# EAGLE schematic gemensamt_avr (EAGLE 7.1.0)

## Sheet 1 of 3: Sensorenhet
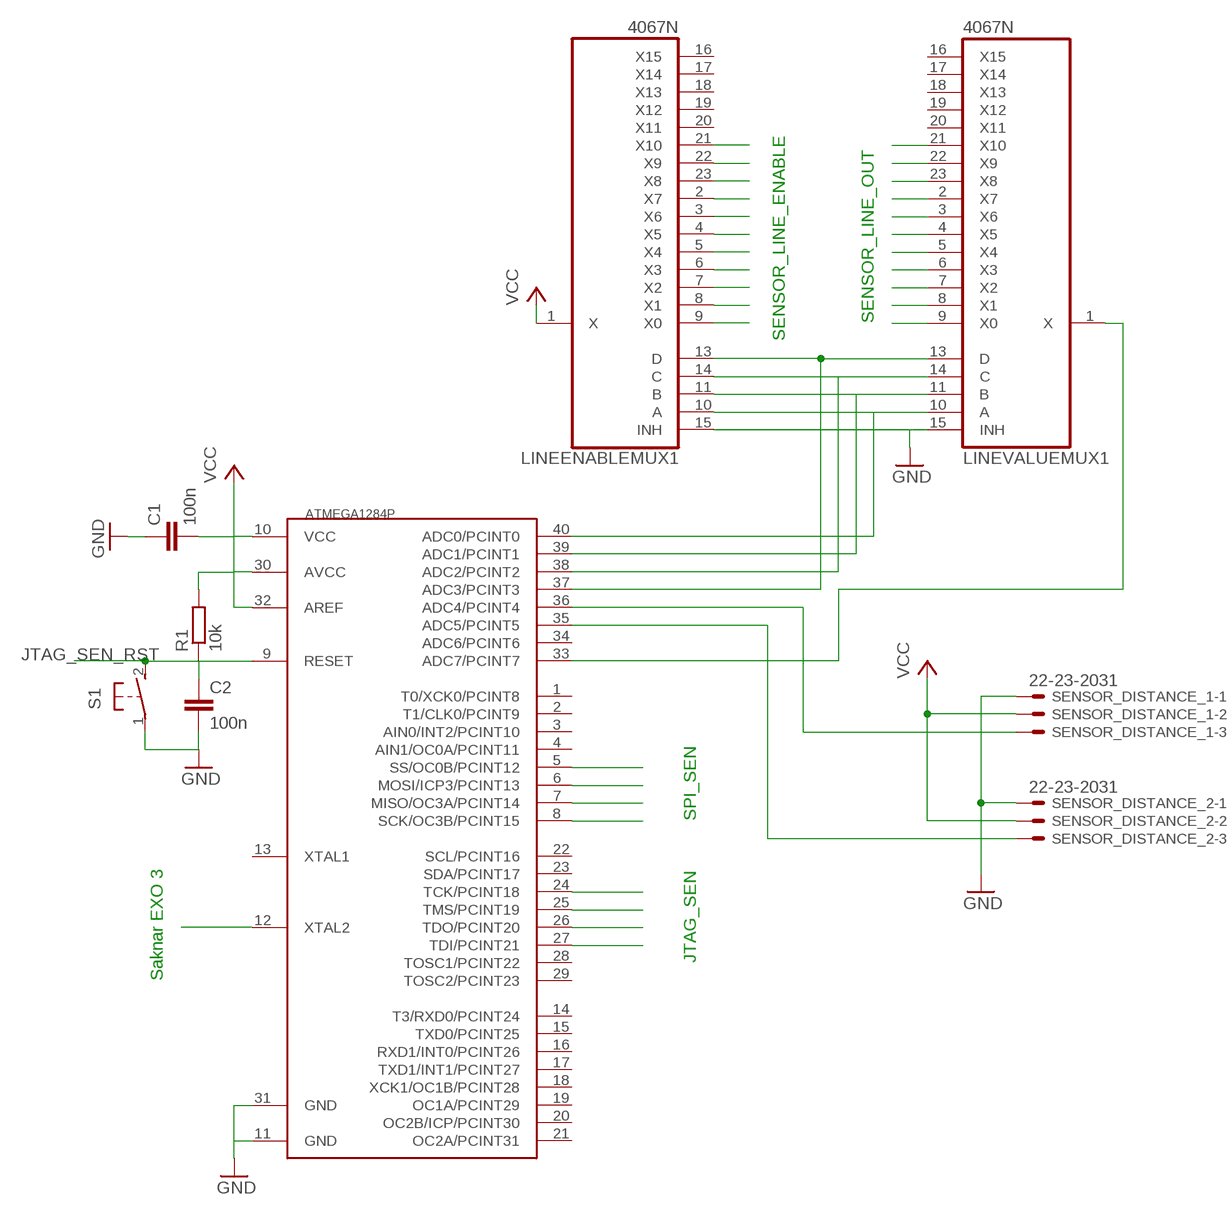
[diagram p0: schematic, sheet 1]

### Parts
ATMEGA1284P  MEGA1284P  [DIL40]
C1  100n  C-EUC1206  [C1206]
C2  100n  C-EUC1206  [C1206]
LINEENABLEMUX1  4067N  [DIL24-6]
LINEVALUEMUX1  4067N  [DIL24-6]
R1  10k  R-EU_V235/17  [V235/17]
S1  31-XX  [B3F-31XX]
SENSOR_DISTANCE_1  22-23-2031  [22-23-2031]
SENSOR_DISTANCE_2  22-23-2031  [22-23-2031]

### Nets
DISTANCELEFT: ATMEGA1284P.36(ADC4/PCINT4) SENSOR_DISTANCE_1.3
DISTANCERIGHT: ATMEGA1284P.35(ADC5/PCINT5) SENSOR_DISTANCE_2.3
GND: ATMEGA1284P.11(GND) ATMEGA1284P.31(GND) C1.1 C2.2 LINEENABLEMUX1.15(INH) LINEVALUEMUX1.15(INH) S1.1(P) SENSOR_DISTANCE_1.1 SENSOR_DISTANCE_2.1 ; also sheet 2,3
JTAG_SEN_RST: ATMEGA1284P.9(RESET) C2.1 R1.1 S1.2(S) ; also sheet 3
JTAG_SEN_TCK: ATMEGA1284P.24(TCK/PCINT18) ; also sheet 3
JTAG_SEN_TDI: ATMEGA1284P.27(TDI/PCINT21) ; also sheet 3
JTAG_SEN_TDO: ATMEGA1284P.26(TDO/PCINT20) ; also sheet 3
JTAG_SEN_TMS: ATMEGA1284P.25(TMS/PCINT19) ; also sheet 3
LINE_0_E: LINEENABLEMUX1.9(X0) ; also sheet 3
LINE_0_OUT: LINEVALUEMUX1.9(X0) ; also sheet 3
LINE_1_E: LINEENABLEMUX1.8(X1) ; also sheet 3
LINE_1_OUT: LINEVALUEMUX1.8(X1) ; also sheet 3
LINE_2_E: LINEENABLEMUX1.7(X2) ; also sheet 3
LINE_2_OUT: LINEVALUEMUX1.7(X2) ; also sheet 3
LINE_3_E: LINEENABLEMUX1.6(X3) ; also sheet 3
LINE_3_OUT: LINEVALUEMUX1.6(X3) ; also sheet 3
LINE_4_E: LINEENABLEMUX1.5(X4) ; also sheet 3
LINE_4_OUT: LINEVALUEMUX1.5(X4) ; also sheet 3
LINE_5_E: LINEENABLEMUX1.4(X5) ; also sheet 3
LINE_5_OUT: LINEVALUEMUX1.4(X5) ; also sheet 3
LINE_6_E: LINEENABLEMUX1.3(X6) ; also sheet 3
LINE_6_OUT: LINEVALUEMUX1.3(X6) ; also sheet 3
LINE_7_E: LINEENABLEMUX1.2(X7) ; also sheet 3
LINE_7_OUT: LINEVALUEMUX1.2(X7) ; also sheet 3
LINE_8_E: LINEENABLEMUX1.23(X8) ; also sheet 3
LINE_8_OUT: LINEVALUEMUX1.23(X8) ; also sheet 3
LINE_9_E: LINEENABLEMUX1.22(X9) ; also sheet 3
LINE_9_OUT: LINEVALUEMUX1.22(X9) ; also sheet 3
LINE_10_E: LINEENABLEMUX1.21(X10) ; also sheet 3
LINE_10_OUT: LINEVALUEMUX1.21(X10) ; also sheet 3
LINEADDR0: ATMEGA1284P.40(ADC0/PCINT0) LINEENABLEMUX1.10(A) LINEVALUEMUX1.10(A)
LINEADDR1: ATMEGA1284P.39(ADC1/PCINT1) LINEENABLEMUX1.11(B) LINEVALUEMUX1.11(B)
LINEADDR2: ATMEGA1284P.38(ADC2/PCINT2) LINEENABLEMUX1.14(C) LINEVALUEMUX1.14(C)
LINEADDR3: ATMEGA1284P.37(ADC3/PCINT3) LINEENABLEMUX1.13(D) LINEVALUEMUX1.13(D)
LINEVALUE: ATMEGA1284P.33(ADC7/PCINT7) LINEVALUEMUX1.1(X)
SEN_CLK: ATMEGA1284P.12(XTAL2)
SPI_MISO: ATMEGA1284P.7(MISO/OC3A/PCINT14) ; also sheet 2
SPI_MOSI: ATMEGA1284P.6(MOSI/ICP3/PCINT13) ; also sheet 2,3
SPI_SCK: ATMEGA1284P.8(SCK/OC3B/PCINT15) ; also sheet 2,3
SPI_SS_SEN: ATMEGA1284P.5(SS/OC0B/PCINT12) ; also sheet 3
VCC: ATMEGA1284P.10(VCC) ATMEGA1284P.30(AVCC) ATMEGA1284P.32(AREF) C1.2 LINEENABLEMUX1.1(X) R1.2 SENSOR_DISTANCE_1.2 SENSOR_DISTANCE_2.2 ; also sheet 2,3
Unconnected: ATMEGA1284P.1(T0/XCK0/PCINT8) ATMEGA1284P.2(T1/CLK0/PCINT9) ATMEGA1284P.3(AIN0/INT2/PCINT10) ATMEGA1284P.4(AIN1/OC0A/PCINT11) ATMEGA1284P.13(XTAL1) ATMEGA1284P.14(T3/RXD0/PCINT24) ATMEGA1284P.15(TXD0/PCINT25) ATMEGA1284P.16(RXD1/INT0/PCINT26) ATMEGA1284P.17(TXD1/INT1/PCINT27) ATMEGA1284P.18(XCK1/OC1B/PCINT28) ATMEGA1284P.19(OC1A/PCINT29) ATMEGA1284P.20(OC2B/ICP/PCINT30) ATMEGA1284P.21(OC2A/PCINT31) ATMEGA1284P.22(SCL/PCINT16) ATMEGA1284P.23(SDA/PCINT17) ATMEGA1284P.28(TOSC1/PCINT22) ATMEGA1284P.29(TOSC2/PCINT23) ATMEGA1284P.34(ADC6/PCINT6) LINEENABLEMUX1.16(X15) LINEENABLEMUX1.17(X14) LINEENABLEMUX1.18(X13) LINEENABLEMUX1.19(X12) LINEENABLEMUX1.20(X11) LINEVALUEMUX1.16(X15) LINEVALUEMUX1.17(X14) LINEVALUEMUX1.18(X13) LINEVALUEMUX1.19(X12) LINEVALUEMUX1.20(X11)

### Notes on the sheet
- SENSOR_LINE_OUT
- SENSOR_LINE_ENABLE
- SPI_SEN
- JTAG_SEN
- Saknar EXO 3

## Sheet 2 of 3: Styrenhet
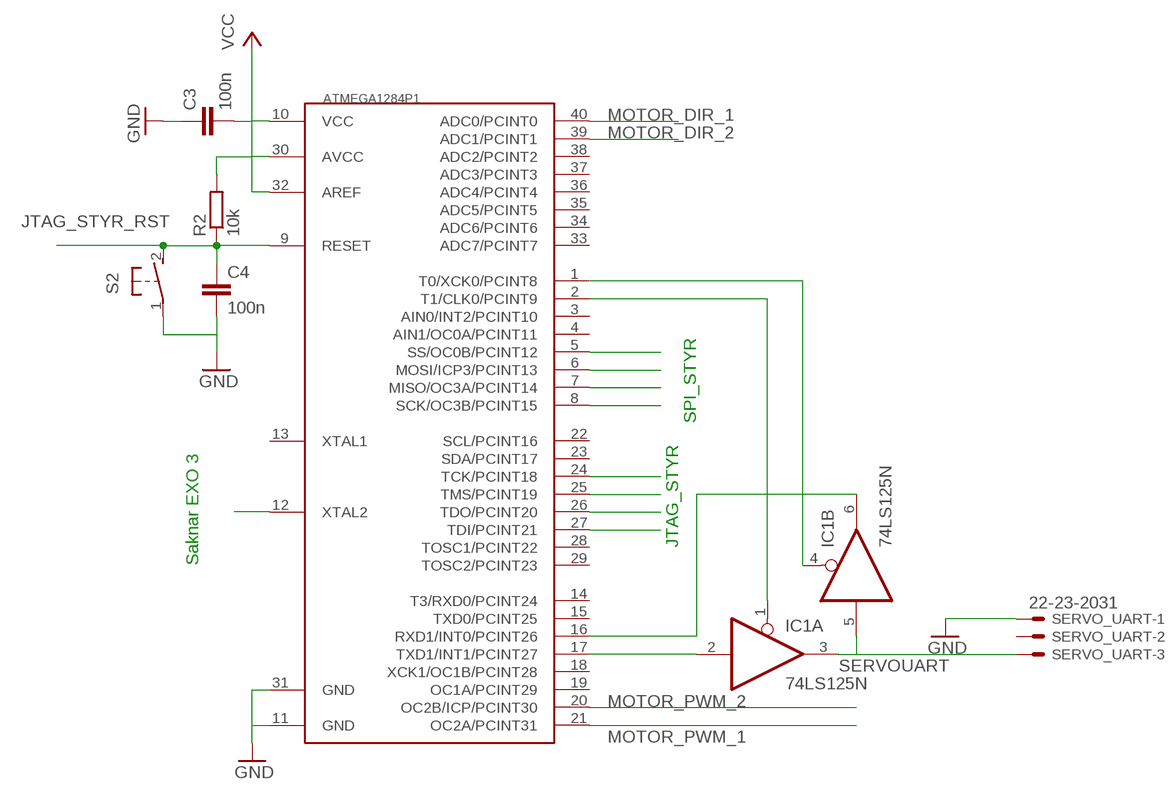
[diagram p1: schematic, sheet 2]

### Parts
ATMEGA1284P1  MEGA1284P  [DIL40]
C3  100n  C-EU025-050X050  [C025-050X050]
C4  100n  C-EU025-050X050  [C025-050X050]
IC1  74LS125N  [DIL14]
R2  10k  R-EU_0204/2V  [0204V]
S2  31-XX  [B3F-31XX]
SERVO_UART  22-23-2031  [22-23-2031]

### Nets
GND: ATMEGA1284P1.11(GND) ATMEGA1284P1.31(GND) C3.1 C4.2 S2.1(P) SERVO_UART.1 ; also sheet 1,3
JTAG_STYR_RST: ATMEGA1284P1.9(RESET) C4.1 R2.1 S2.2(S) ; also sheet 3
MOTOR_DIR_1: ATMEGA1284P1.40(ADC0/PCINT0) ; also sheet 3
MOTOR_DIR_2: ATMEGA1284P1.39(ADC1/PCINT1) ; also sheet 3
SERVOUART: IC1.3(A:O) IC1.5(B:I) SERVO_UART.3
STYR_CLK: ATMEGA1284P1.12(XTAL2)
STYR_UART_RX_E: ATMEGA1284P1.1(T0/XCK0/PCINT8) IC1.4(B:OE)
STYR_UART_TX_E: ATMEGA1284P1.2(T1/CLK0/PCINT9) IC1.1(A:OE)
UART1RX: ATMEGA1284P1.16(RXD1/INT0/PCINT26) IC1.6(B:O)
UART1TX: ATMEGA1284P1.17(TXD1/INT1/PCINT27) IC1.2(A:I)
VCC: ATMEGA1284P1.10(VCC) ATMEGA1284P1.30(AVCC) ATMEGA1284P1.32(AREF) C3.2 R2.2 ; also sheet 1,3
Unconnected: ATMEGA1284P1.3(AIN0/INT2/PCINT10) ATMEGA1284P1.4(AIN1/OC0A/PCINT11) ATMEGA1284P1.5(SS/OC0B/PCINT12) ATMEGA1284P1.6(MOSI/ICP3/PCINT13) ATMEGA1284P1.7(MISO/OC3A/PCINT14) ATMEGA1284P1.8(SCK/OC3B/PCINT15) ATMEGA1284P1.13(XTAL1) ATMEGA1284P1.14(T3/RXD0/PCINT24) ATMEGA1284P1.15(TXD0/PCINT25) ATMEGA1284P1.18(XCK1/OC1B/PCINT28) ATMEGA1284P1.19(OC1A/PCINT29) ATMEGA1284P1.20(OC2B/ICP/PCINT30) ATMEGA1284P1.21(OC2A/PCINT31) ATMEGA1284P1.22(SCL/PCINT16) ATMEGA1284P1.23(SDA/PCINT17) ATMEGA1284P1.24(TCK/PCINT18) ATMEGA1284P1.25(TMS/PCINT19) ATMEGA1284P1.26(TDO/PCINT20) ATMEGA1284P1.27(TDI/PCINT21) ATMEGA1284P1.28(TOSC1/PCINT22) ATMEGA1284P1.29(TOSC2/PCINT23) ATMEGA1284P1.33(ADC7/PCINT7) ATMEGA1284P1.34(ADC6/PCINT6) ATMEGA1284P1.35(ADC5/PCINT5) ATMEGA1284P1.36(ADC4/PCINT4) ATMEGA1284P1.37(ADC3/PCINT3) ATMEGA1284P1.38(ADC2/PCINT2) IC1.8(C:O) IC1.9(C:I) IC1.10(C:OE) IC1.11(D:O) IC1.12(D:I) IC1.13(D:OE) SERVO_UART.2

### Notes on the sheet
- SPI_STYR
- JTAG_STYR
- Saknar EXO 3

## Sheet 3 of 3: Allmänt
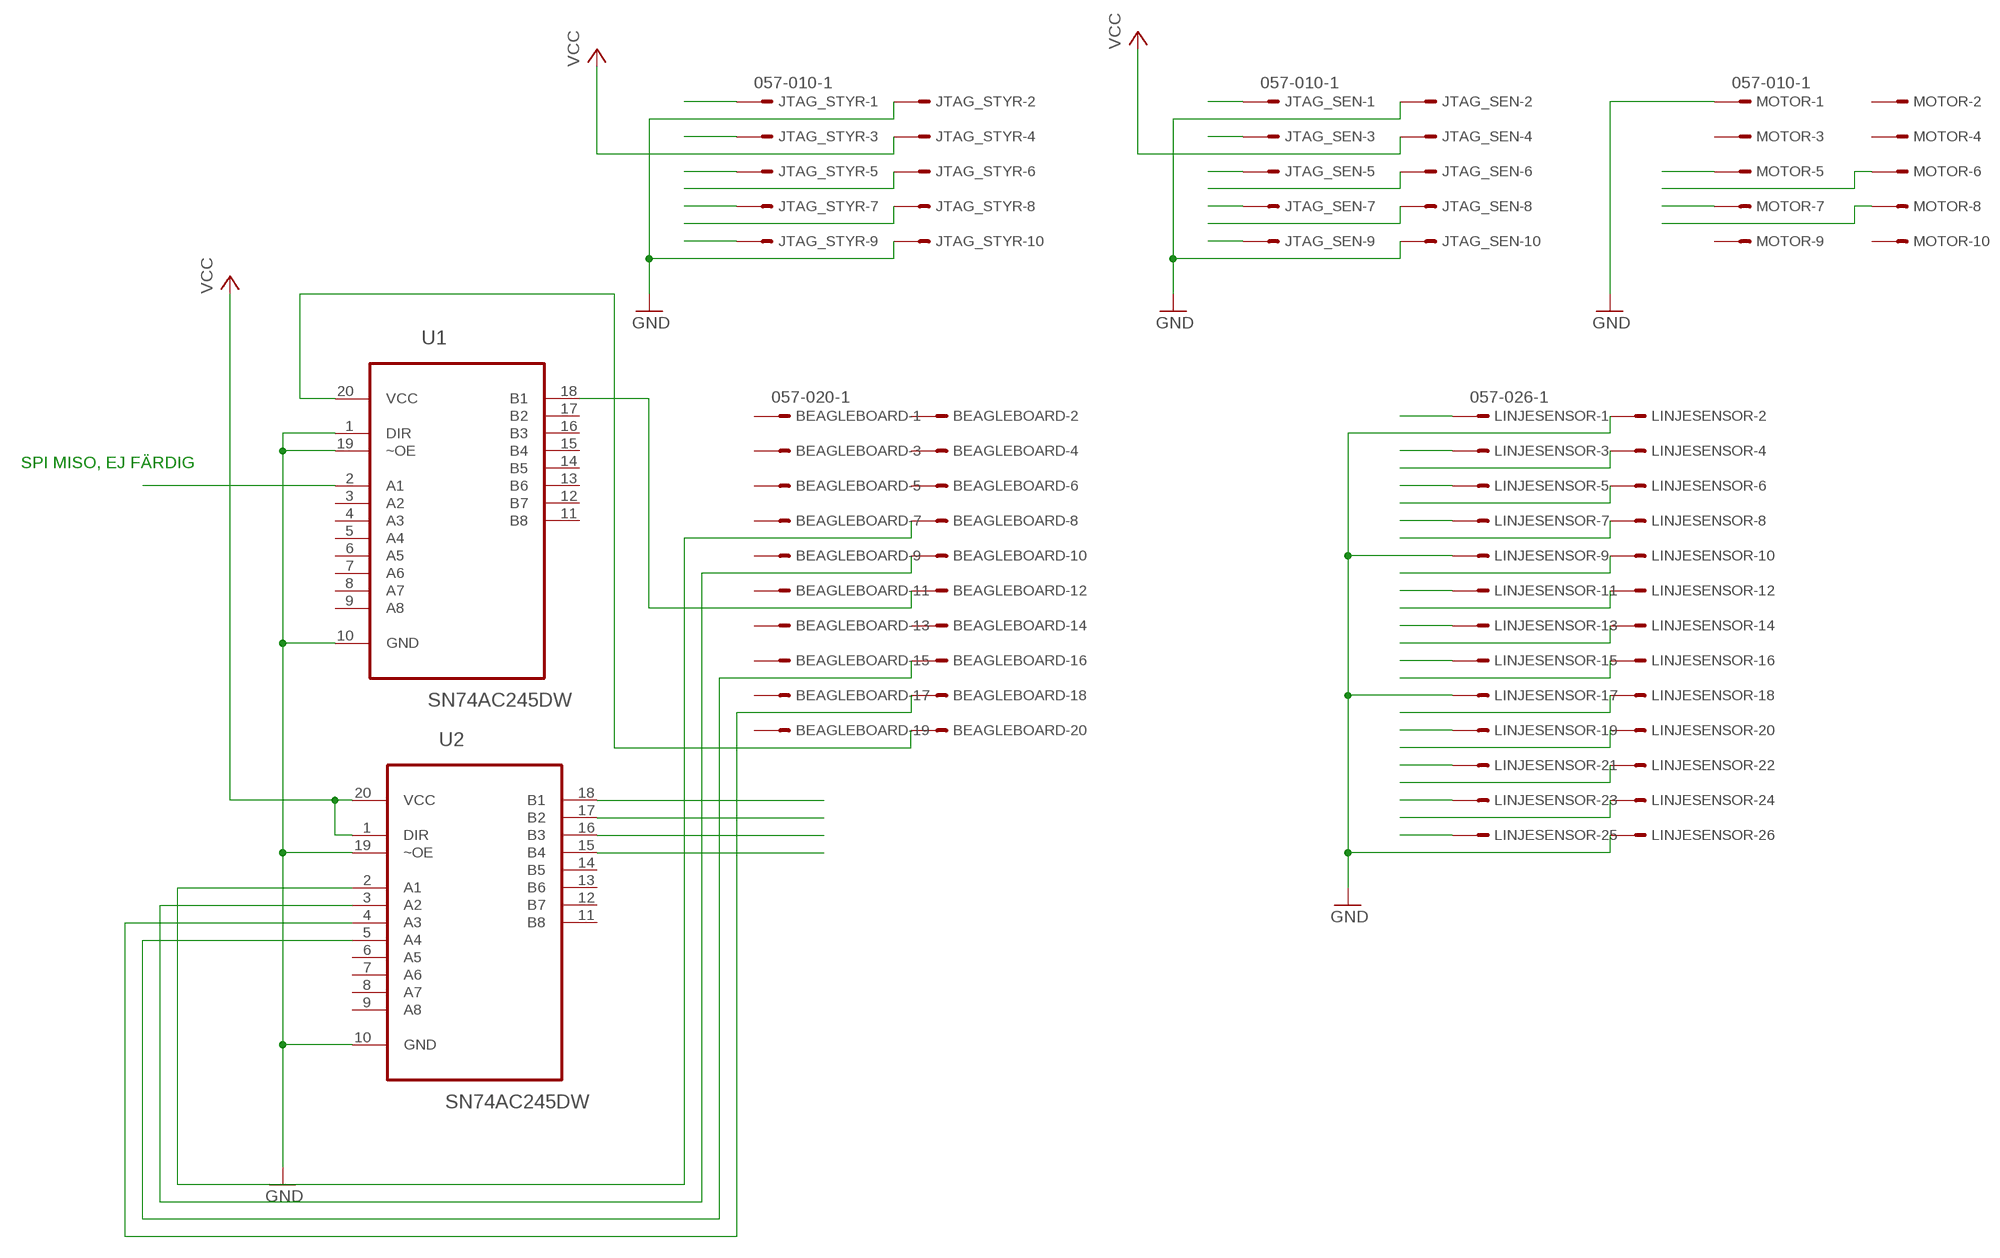
[diagram p2: schematic, sheet 3]

### Parts
BEAGLEBOARD  057-020-1  [057-020-1]
JTAG_SEN  057-010-1  [057-010-1]
JTAG_STYR  057-010-1  [057-010-1]
LINJESENSOR  057-026-1  [057-026-1]
MOTOR  057-010-1  [057-010-1]
U1  SN74AC245DW  [SOIC127P1030X265-20N]
U2  SN74AC245DW  [SOIC127P1030X265-20N]

### Nets
GND: JTAG_SEN.2 JTAG_SEN.10 JTAG_STYR.2 JTAG_STYR.10 LINJESENSOR.2 LINJESENSOR.9 LINJESENSOR.17 LINJESENSOR.26 MOTOR.1 U1.1(DIR) U1.10(GND) U1.19(~OE) U2.10(GND) U2.19(~OE) ; also sheet 1,2
JTAG_SEN_RST: JTAG_SEN.6 ; also sheet 1
JTAG_SEN_TCK: JTAG_SEN.1 ; also sheet 1
JTAG_SEN_TDI: JTAG_SEN.9 ; also sheet 1
JTAG_SEN_TDO: JTAG_SEN.3 ; also sheet 1
JTAG_SEN_TMS: JTAG_SEN.5 ; also sheet 1
JTAG_STYR_RST: JTAG_STYR.6 ; also sheet 2
JTAG_STYR_TCK: JTAG_STYR.1 ; also sheet 2
JTAG_STYR_TDI: JTAG_STYR.9 ; also sheet 2
JTAG_STYR_TDO: JTAG_STYR.3 ; also sheet 2
JTAG_STYR_TMS: JTAG_STYR.5 ; also sheet 2
LINE_0_E: LINJESENSOR.1 ; also sheet 1
LINE_0_OUT: LINJESENSOR.4 ; also sheet 1
LINE_1_E: LINJESENSOR.3 ; also sheet 1
LINE_1_OUT: LINJESENSOR.6 ; also sheet 1
LINE_2_E: LINJESENSOR.5 ; also sheet 1
LINE_2_OUT: LINJESENSOR.8 ; also sheet 1
LINE_3_E: LINJESENSOR.7 ; also sheet 1
LINE_3_OUT: LINJESENSOR.10 ; also sheet 1
LINE_4_E: LINJESENSOR.11 ; also sheet 1
LINE_4_OUT: LINJESENSOR.12 ; also sheet 1
LINE_5_E: LINJESENSOR.13 ; also sheet 1
LINE_5_OUT: LINJESENSOR.14 ; also sheet 1
LINE_6_E: LINJESENSOR.15 ; also sheet 1
LINE_6_OUT: LINJESENSOR.16 ; also sheet 1
LINE_7_E: LINJESENSOR.19 ; also sheet 1
LINE_7_OUT: LINJESENSOR.18 ; also sheet 1
LINE_8_E: LINJESENSOR.21 ; also sheet 1
LINE_8_OUT: LINJESENSOR.20 ; also sheet 1
LINE_9_E: LINJESENSOR.23 ; also sheet 1
LINE_9_OUT: LINJESENSOR.22 ; also sheet 1
LINE_10_E: LINJESENSOR.25 ; also sheet 1
LINE_10_OUT: LINJESENSOR.24 ; also sheet 1
MISO: BEAGLEBOARD.12 U1.18(B1)
MOSI: BEAGLEBOARD.10 U2.3(A2)
MOTOR_DIR_1: MOTOR.5 ; also sheet 2
MOTOR_DIR_2: MOTOR.6 ; also sheet 2
MOTOR_PWM_1: MOTOR.7 ; also sheet 2
MOTOR_PWM_2: MOTOR.8 ; also sheet 2
N$2: U1.2(A1)
N$11: JTAG_STYR.7
N$12: JTAG_SEN.7
N$13: JTAG_STYR.8
N$14: JTAG_SEN.8
SCK: BEAGLEBOARD.8 U2.2(A1)
SPI_MOSI: U2.17(B2) ; also sheet 1,2
SPI_SCK: U2.18(B1) ; also sheet 1,2
SPI_SS_SEN: U2.15(B4) ; also sheet 1
SPI_SS_STYR: U2.16(B3) ; also sheet 2
SS_SEN: BEAGLEBOARD.16 U2.5(A4)
SS_STYR: BEAGLEBOARD.18 U2.4(A3)
VCC: JTAG_SEN.4 JTAG_STYR.4 U2.1(DIR) U2.20(VCC) ; also sheet 1,2
VCC_BEAGLEBOARD: BEAGLEBOARD.20 U1.20(VCC)
Unconnected: BEAGLEBOARD.1 BEAGLEBOARD.2 BEAGLEBOARD.3 BEAGLEBOARD.4 BEAGLEBOARD.5 BEAGLEBOARD.6 BEAGLEBOARD.7 BEAGLEBOARD.9 BEAGLEBOARD.11 BEAGLEBOARD.13 BEAGLEBOARD.14 BEAGLEBOARD.15 BEAGLEBOARD.17 BEAGLEBOARD.19 MOTOR.2 MOTOR.3 MOTOR.4 MOTOR.9 MOTOR.10 U1.3(A2) U1.4(A3) U1.5(A4) U1.6(A5) U1.7(A6) U1.8(A7) U1.9(A8) U1.11(B8) U1.12(B7) U1.13(B6) U1.14(B5) U1.15(B4) U1.16(B3) U1.17(B2) U2.6(A5) U2.7(A6) U2.8(A7) U2.9(A8) U2.11(B8) U2.12(B7) U2.13(B6) U2.14(B5)

### Notes on the sheet
- SPI MISO, EJ FÄRDIG

## Power pins joined to a net without a drawn wire
GND: IC1.7(P:GND)
VCC: IC1.14(P:VCC)
VDD: LINEENABLEMUX1.24(VDD) LINEVALUEMUX1.24(VDD)
VSS: LINEENABLEMUX1.12(VSS) LINEVALUEMUX1.12(VSS)

## Library data of the parts
ATMEGA1284P ATMEGA1284P1 = 1284p:MEGA1284P: Atmel ATmega1284P 8-bit AVR Microcontroller
BEAGLEBOARD = con-panduit:057-020-: CONNECTOR 20-pin series 057 contact pc board low profile headers; OC_FARNELL: unknown; OC_NEWARK: unknown
C1-C4 = rcl:C-EU: CAPACITOR, European symbol
IC1 = 74xx-eu:74*125: Quad bus BUFFER, 3-state
JTAG_SEN JTAG_STYR MOTOR = con-panduit:057-010-: CONNECTOR 10-pin series 057 contact pc board low profile headers; OC_FARNELL: unknown; OC_NEWARK: unknown
LINEENABLEMUX1 LINEVALUEMUX1 = 40xx:4067: 16-channel ANALOG MULTIPLEXER
LINJESENSOR = con-panduit:057-026-: CONNECTOR 20-pin series 057 contact pc board low profile headers; OC_FARNELL: unknown; OC_NEWARK: unknown
R1 R2 = resistor:R-EU_: RESISTOR, European symbol
S1 S2 = switch-omron:31-XX: OMRON SWITCH; MPN: B3F-3100; OC_FARNELL: 959704; OC_NEWARK: 36M3582
SENSOR_DISTANCE_1 SENSOR_DISTANCE_2 SERVO_UART = con-molex:22-23-2031: .100" (2.54mm) Center Header - 3 Pin; MF: MOLEX; MPN: 22-23-2031; OC_FARNELL: 1462950; OC_NEWARK: 30C0862
U1 U2 = Texas Instruments_By_element14_Batch_1:SN74AC245DW: OCTAL BUS TRANSCEIVERS WITH 3-STATE OUTPUTS; MPN: SN74AC245DW; OC_FARNELL: -; OC_NEWARK: 66F4601; PACKAGE: SOIC-20; SUPPLIER: Texas Instruments